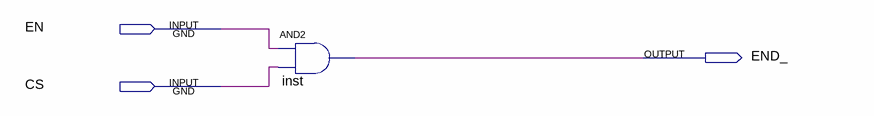
[diagram p0: schematic sheet]
// Quartus schematic NOP.bdf as structural Verilog: 1 symbols, 3 pins
module NOP (
  input  EN,
  input  CS,
  output END_
);

  and inst (END_, EN, CS);
endmodule
